# EAGLE design RAMPS_1-3i (EAGLE 5.11)
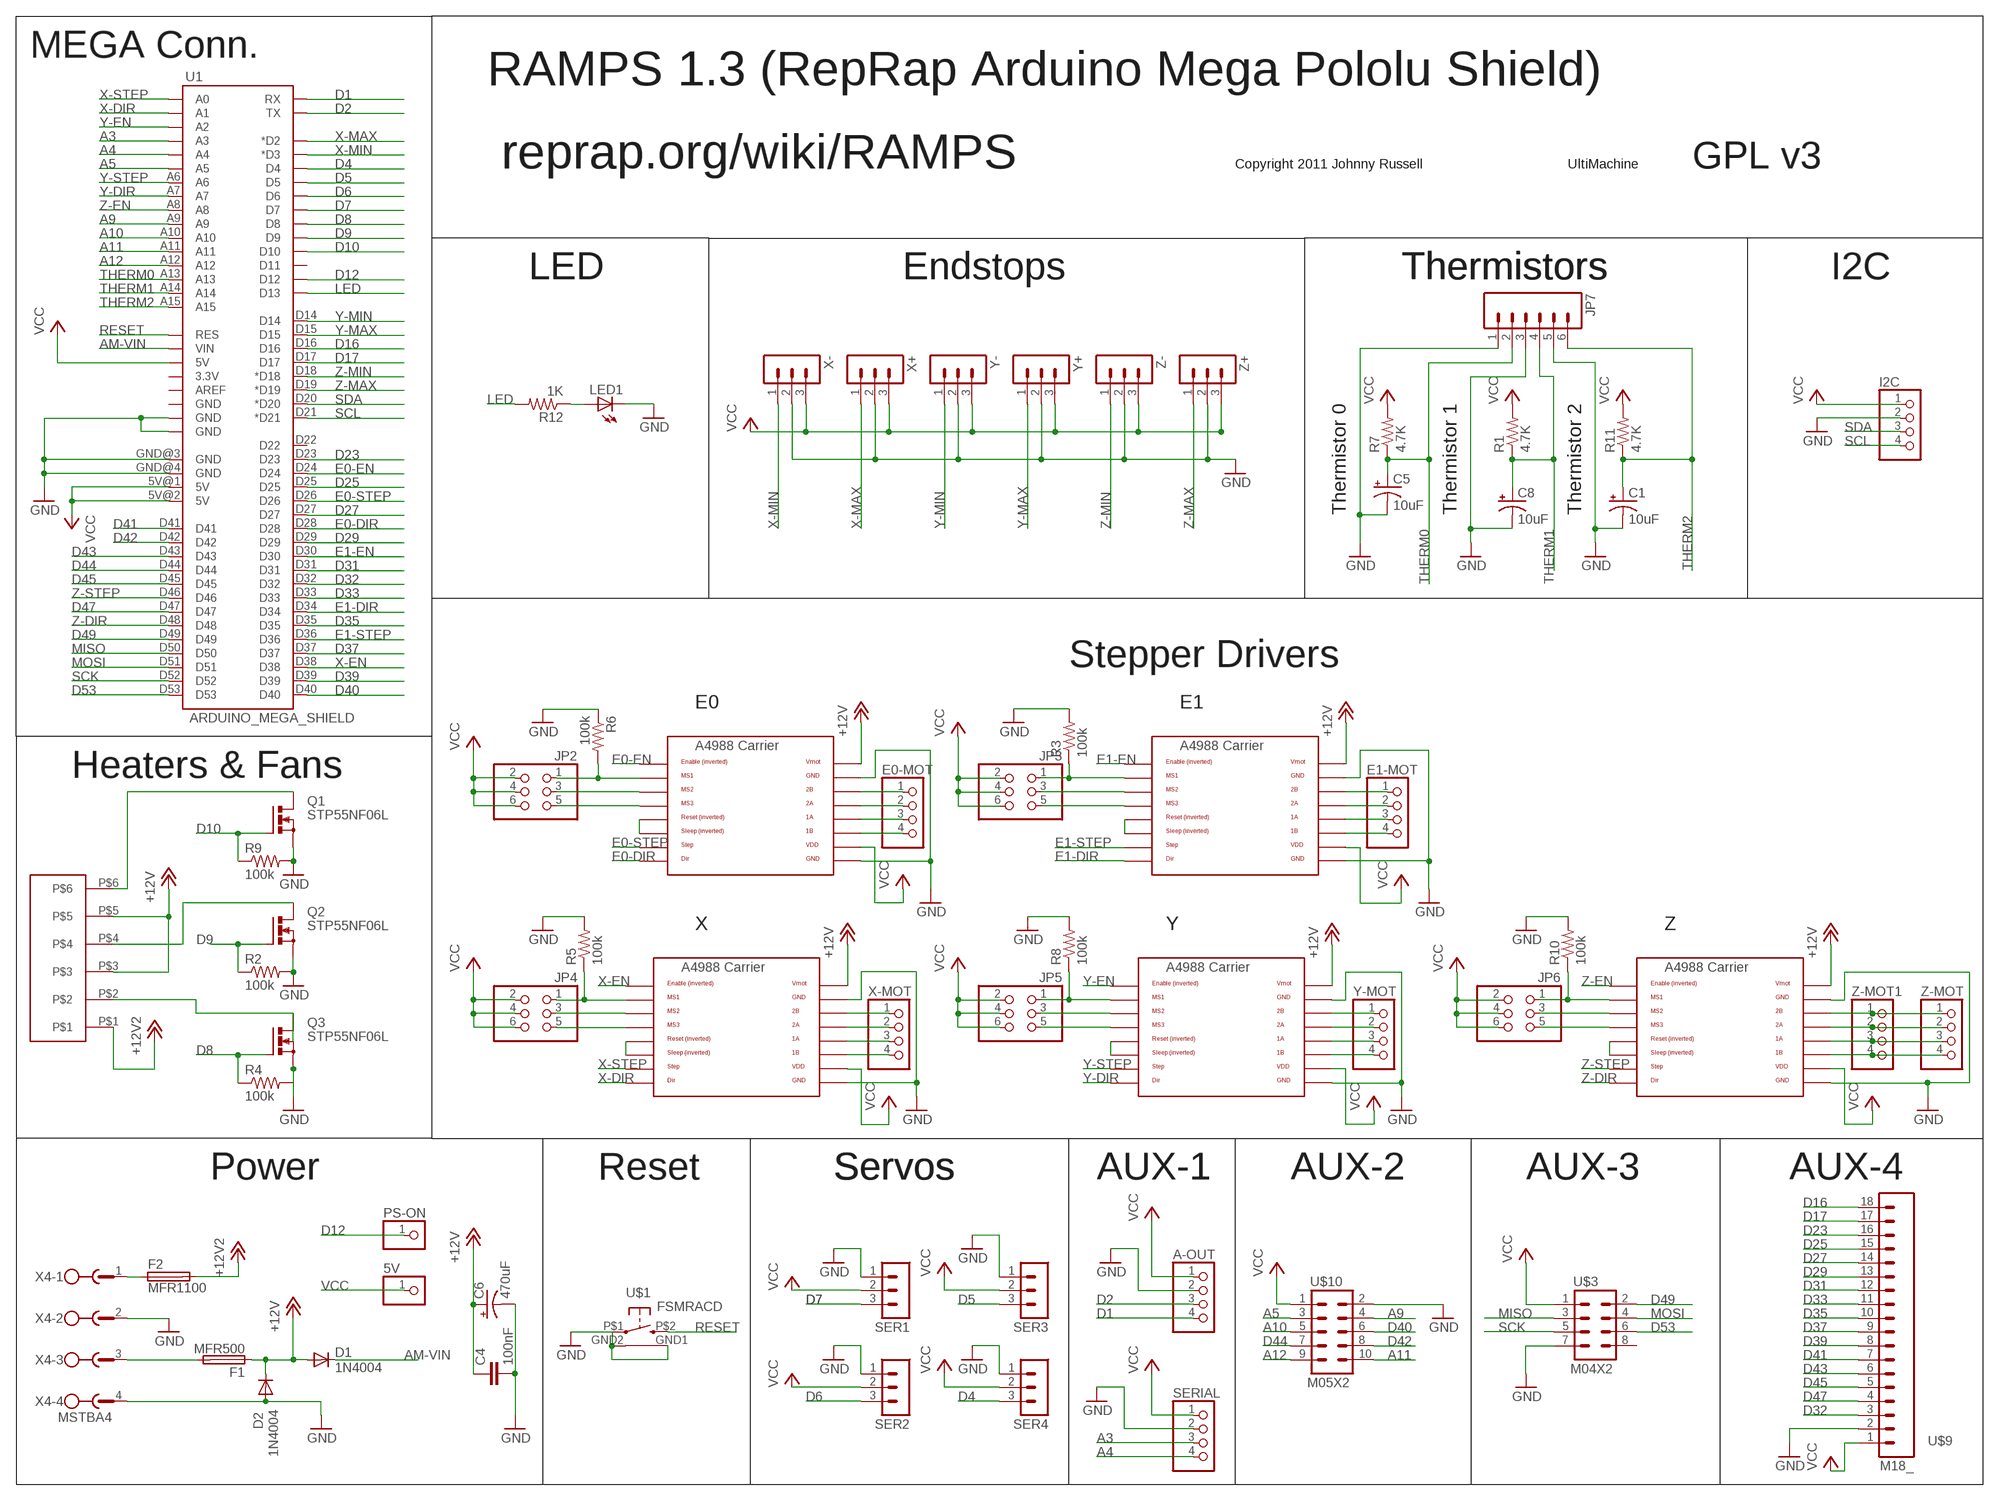
[diagram p0: schematic, sheet 1]

## Parts
5V  PINHD-1X1  [1X01]
A-OUT  PINHD-1X4  [1X04]
C1  10uF  CPOL-USE2.5-5  [E2,5-5]
C4  100nF  C2,5-3  [C2.5-3]
C5  10uF  CPOL-USE2.5-5  [E2,5-5]
C6  470uF  CPOL-USE3.5-8  [E3,5-8]
C8  10uF  CPOL-USE2.5-5  [E2,5-5]
D1  1N4004  [DO41-10]
D2  1N4004  [DO41-10]
E0-MOT  PINHD-1X4  [1X04]
E1-MOT  PINHD-1X4  [1X04]
F1  MFR500  PTCFUSE  [MFR500]
F2  MFR1100  PTCFUSEMFR1100  [MFR1100]
I2C  PINHD-1X4  [1X04]
JP2  PINHD-2X3  [2X03]
JP3  PINHD-2X3  [2X03]
JP4  PINHD-2X3  [2X03]
JP5  PINHD-2X3  [2X03]
JP6  PINHD-2X3  [2X03]
JP7  M06SIP  [1X06]
LED1  LED3MM  [LED3MM]
PS-ON  PINHD-1X1  [1X01]
Q1  STP55NF06L  IRF512  [TO220BV]
Q2  STP55NF06L  IRF512  [TO220BV]
Q3  STP55NF06L  IRF512  [TO220BV]
R1  4.7K  R-US_0207/7  [0207/7]
R2  100k  R-US_0207/7  [0207/7]
R3  100k  R-US_0207/7  [0207/7]
R4  100k  R-US_0207/7  [0207/7]
R5  100k  R-US_0207/7  [0207/7]
R6  100k  R-US_0207/7  [0207/7]
R7  4.7K  R-US_0207/7  [0207/7]
R8  100k  R-US_0207/7  [0207/7]
R9  100k  R-US_0207/7  [0207/7]
R10  100k  R-US_0207/7  [0207/7]
R11  4.7K  R-US_0207/7  [0207/7]
R12  1K  R-US_0207/7  [0207/7]
SER1  3PIN-HEADER  [3PIN-HEADER]
SER2  3PIN-HEADER  [3PIN-HEADER]
SER3  3PIN-HEADER  [3PIN-HEADER]
SER4  3PIN-HEADER  [3PIN-HEADER]
SERIAL  PINHD-1X4  [1X04]
U1  ARDUINO_MEGA_SHIELD  [ARDUINO_MEGA_SHIELD]
U$1  FSMRACD  [FSMRACD]
U$2  282837-6  [282837-6]
U$3  M04X2  [2X4]
U$4  A4988BREAKOUT  [A4988BREAKOUT]
U$5  A4988BREAKOUT  [A4988BREAKOUT]
U$6  A4988BREAKOUT  [A4988BREAKOUT]
U$7  A4988BREAKOUT  [A4988BREAKOUT]
U$8  A4988BREAKOUT  [A4988BREAKOUT]
U$9  M18_  [1X18]
U$10  M05X2  [2X5]
X4  MSTBA4  [MSTBA4]
X+  3PIN-HEADER  [3PIN-HEADER]
X-  3PIN-HEADER  [3PIN-HEADER]
X-MOT  PINHD-1X4  [1X04]
Y+  3PIN-HEADER  [3PIN-HEADER]
Y-  3PIN-HEADER  [3PIN-HEADER]
Y-MOT  PINHD-1X4  [1X04]
Z+  3PIN-HEADER  [3PIN-HEADER]
Z-  3PIN-HEADER  [3PIN-HEADER]
Z-MOT  PINHD-1X4  [1X04]
Z-MOT1  PINHD-1X4  [1X04]

## Nets
+12V: C4.1 C6.+ D1.A D2.C F1.1 U$2.P$3 U$2.P$5 U$4.VMOT U$5.VMOT U$6.VMOT U$7.VMOT U$8.VMOT
+12V2: F2.2 U$2.P$1
A3: SERIAL.3 U1.A3
A4: SERIAL.4 U1.A4
A5: U1.A5 U$10.3
A9: U1.A9 U$10.4
A10: U1.A10 U$10.5
A11: U1.A11 U$10.10
A12: U1.A12 U$10.9
AM-VIN: D1.C U1.VIN
D1: A-OUT.4 U1.RX
D2: A-OUT.3 U1.TX
D4: SER4.3 U1.D4
D5: SER3.3 U1.D5
D6: SER2.3 U1.D6
D7: SER1.3 U1.D7
D8: Q3.G R4.1 U1.D8
D9: Q2.G R2.1 U1.D9
D10: Q1.G R9.1 U1.D10
D12: PS-ON.1 U1.D12
D16: U1.D16 U$9.18
D17: U1.D17 U$9.17
D23: U1.D23 U$9.16
D25: U1.D25 U$9.15
D27: U1.D27 U$9.14
D29: U1.D29 U$9.13
D31: U1.D31 U$9.12
D32: U1.D32 U$9.3
D33: U1.D33 U$9.11
D35: U1.D35 U$9.10
D37: U1.D37 U$9.9
D39: U1.D39 U$9.8
D40: U1.D40 U$10.6
D41: U1.D41 U$9.7
D42: U1.D42 U$10.8
D43: U1.D43 U$9.6
D44: U1.D44 U$10.7
D45: U1.D45 U$9.5
D47: U1.D47 U$9.4
D49: U1.D49 U$3.2
D53: U1.D53 U$3.6
E0-DIR: U1.D28 U$4.DIR
E0-EN: U1.D24 U$4.EN
E0-STEP: U1.D26 U$4.STEP
E1-DIR: U1.D34 U$5.DIR
E1-EN: U1.D30 U$5.EN
E1-STEP: U1.D36 U$5.STEP
GND: A-OUT.2 C1.- C4.2 C5.- C6.- C8.- D2.A I2C.2 JP7.1 JP7.3 JP7.5 LED1.K(C) Q1.S Q2.S Q3.S R2.2 R3.2 R4.2 R5.2 R6.1 R8.2 R9.2 R10.2 SER1.1 SER2.1 SER3.1 SER4.1 SERIAL.2 U1.GND@0(GND) U1.GND@1(GND) U1.GND@3(GND) U1.GND@4(GND) U$1.GND1 U$1.GND2 U$1.P$1(P) U$3.7 U$4.GND U$4.GND@0(GND) U$5.GND U$5.GND@0(GND) U$6.GND U$6.GND@0(GND) U$7.GND U$7.GND@0(GND) U$8.GND U$8.GND@0(GND) U$9.2 U$10.2 X4.2 X4.4 X+.2 X-.2 Y+.2 Y-.2 Z+.2 Z-.2
LED: R12.2 U1.D13
MISO: U1.D50 U$3.3
MOSI: U1.D51 U$3.4
N$1: Q2.D U$2.P$4
N$2: Q3.D U$2.P$2
N$3: E0-MOT.1 U$4.2B
N$4: E0-MOT.2 U$4.2A
N$5: JP2.1 R6.2 U$4.MS1
N$6: JP2.5 U$4.MS3
N$7: Q1.D U$2.P$6
N$8: U$4.RST U$4.SLP(SLEEP)
N$9: JP2.3 U$4.MS2
N$10: E0-MOT.3 U$4.1A
N$11: E0-MOT.4 U$4.1B
N$12: E1-MOT.1 U$5.2B
N$13: E1-MOT.2 U$5.2A
N$14: JP4.1 R5.1 U$6.MS1
N$15: JP4.3 U$6.MS2
N$16: E1-MOT.3 U$5.1A
N$17: JP5.3 U$7.MS2
N$18: E1-MOT.4 U$5.1B
N$19: JP4.5 U$6.MS3
N$20: U$6.RST U$6.SLP(SLEEP)
N$21: U$6.2B X-MOT.1
N$22: U$6.2A X-MOT.2
N$23: U$7.RST U$7.SLP(SLEEP)
N$24: U$5.RST U$5.SLP(SLEEP)
N$25: JP3.1 R3.1 U$5.MS1
N$26: U$6.1A X-MOT.3
N$27: U$6.1B X-MOT.4
N$28: U$7.2B Y-MOT.1
N$29: U$7.2A Y-MOT.2
N$30: U$7.1A Y-MOT.3
N$31: JP5.5 U$7.MS3
N$32: F1.2 X4.3
N$33: JP5.1 R8.1 U$7.MS1
N$34: JP3.5 U$5.MS3
N$35: JP3.3 U$5.MS2
N$36: U$7.1B Y-MOT.4
N$37: JP6.3 U$8.MS2
N$38: U$8.RST U$8.SLP(SLEEP)
N$39: JP6.5 U$8.MS3
N$40: JP6.1 R10.1 U$8.MS1
N$41: U$8.2B Z-MOT1.1 Z-MOT.1
N$42: U$8.2A Z-MOT1.2 Z-MOT.2
N$43: U$8.1A Z-MOT1.3 Z-MOT.3
N$44: U$8.1B Z-MOT1.4 Z-MOT.4
N$45: F2.1 X4.1
N$46: LED1.A R12.1
RESET: U1.RES U$1.P$2(S)
SCK: U1.D52 U$3.5
SCL: I2C.4 U1.D21(*D21)
SDA: I2C.3 U1.D20(*D20)
THERM0: C5.+ JP7.2 R7.1 U1.A13
THERM1: C8.+ JP7.4 R1.1 U1.A14
THERM2: C1.+ JP7.6 R11.1 U1.A15
VCC: 5V.1 A-OUT.1 I2C.1 JP2.2 JP2.4 JP2.6 JP3.2 JP3.4 JP3.6 JP4.2 JP4.4 JP4.6 JP5.2 JP5.4 JP5.6 JP6.2 JP6.4 JP6.6 R1.2 R7.2 R11.2 SER1.2 SER2.2 SER3.2 SER4.2 SERIAL.1 U1.5V@0(5V) U1.5V@1(5V) U1.5V@2(5V) U$3.1 U$4.VDD U$5.VDD U$6.VDD U$7.VDD U$8.VDD U$9.1 U$10.1 X+.3 X-.3 Y+.3 Y-.3 Z+.3 Z-.3
X-DIR: U1.A1 U$6.DIR
X-EN: U1.D38 U$6.EN
X-MAX: U1.D2(*D2) X+.1
X-MIN: U1.D3(*D3) X-.1
X-STEP: U1.A0 U$6.STEP
Y-DIR: U1.A7 U$7.DIR
Y-EN: U1.A2 U$7.EN
Y-MAX: U1.D15 Y+.1
Y-MIN: U1.D14 Y-.1
Y-STEP: U1.A6 U$7.STEP
Z-DIR: U1.D48 U$8.DIR
Z-EN: U1.A8 U$8.EN
Z-MAX: U1.D19(*D19) Z+.1
Z-MIN: U1.D18(*D18) Z-.1
Z-STEP: U1.D46 U$8.STEP
Unconnected: U1.3.3V U1.AREF U1.D11 U1.D22 U1.GND@2(GND) U$3.8

## Notes on the sheet
- MEGA Conn.
- RAMPS 1.3 (RepRap Arduino Mega Pololu Shield)
- reprap.org/wiki/RAMPS | Copyright 2011 Johnny Russell | UltiMachine | GPL v3
- LED | Endstops | Thermistors | Thermistors | I2C
- Thermistor 0 | Thermistor 1 | Thermistor 2
- Stepper Drivers
- E0 | E1
- Heaters & Fans
- X | Y | Z
- Power | Reset | Servos | Servos | AUX-1 | AUX-2 | AUX-3 | AUX-4

## Library data of the parts
5V PS-ON = adafruit:PINHD-1X1: Pin header 1x1 for 0.1" spacing With round pins
A-OUT E0-MOT E1-MOT I2C SERIAL X-MOT Y-MOT Z-MOT Z-MOT1 = RepRapjr:PINHD-1X4: PIN HEADER
C1 C5 C6 C8 = adafruit:CPOL-US: POLARIZED CAPACITOR, American symbol
C4 = capacitor-wima:C: CAPACITOR naming: grid - package width
D1 D2 = diode:1N4004: DIODE general purpose rectifier, 1 A
F1 F2 = RepRapjr:PTCFUSE: LITTLEFUSE Picofuse/slow Littlefuse
JP2-JP6 = pinhead:PINHD-2X3: PIN HEADER
JP7 = SparkFun:M06: Header 6 Standard 6-pin 0.1" header. Use with straight break away headers (SKU : PRT-00116), right angle break away headers (PRT-00553), swiss pins (PRT-00743), machine pins (PRT-00117), and female headers (PRT-00115). Molex polarized connector foot print use with SKU : PRT-08094 with associated crimp pins and housings. NOTES ON THE VARIANTS LOCK and LOCK_LONGPADS... This footprint was designed to help hold the alignment of a through-hole component (i.e. 6-pin header) while soldering it into place. You may notice that each hole has been shifted either up or down by 0.005 of an inch from it's more standard position (which is a perfectly straight line). This slight alteration caused the pins (the squares in the middle) to touch the edges of the holes. Because they are alternating, it causes a "brace" to hold the component in place. 0.005 has proven to be the perfect amount of "off-center" position when using our standard breakaway headers. Although looks a little odd when you look at the bare footprint, once you have a header in there, the alteration is very hard to notice. Also, if you push a header all the way into place, it is covered up entirely on the bottom side. This idea of altering the position of holes to aid alignment will be further integrated into the Sparkfun Library for other footprints. It can help hold any component with 3 or more connection pins.
LED1 = led:LED: LED OSRAM: - CHIPLED LG R971, LG N971, LY N971, LG Q971, LY Q971, LO R971, LY R971 LH N974, LH R974 LS Q976, LO Q976, LY Q976 LO Q996 - Hyper CHIPLED LW Q18S LB Q993, LB Q99A, LB R99A - SideLED LS A670, LO A670, LY A670, LG A670, LP A670 LB A673, LV A673, LT A673, LW A673 LH A674 LY A675 LS A676, LA A676, LO A676, LY A676, LW A676 LS A679, LY A679, LG A679 - Hyper Micro SIDELED® LS Y876, LA Y876, LO Y876, LY Y876 LT Y87S - SmartLED LW L88C, LW L88S LB L89C, LB L89S, LG L890 LS L89K, LO L89K, LY L89K LS L896, LA L896, LO L896, LY L896 - TOPLED LS T670, LO T670, LY T670, LG T670, LP T670 LSG T670, LSP T670, LSY T670, LOP T670, LYG T670 LG T671, LOG T671, LSG T671 LB T673, LV T673, LT T673, LW T673 LH T674 LS T676, LA T676, LO T676, LY T676, LB T676, LH T676, LSB T676, LW T676 LB T67C, LV T67C, LT T67C, LS T67K, LO T67K, LY T67K, LW E67C LS E67B, LA E67B, LO E67B, LY E67B, LB E67C, LV E67C, LT E67C LW T67C LS T679, LY T679, LG T679 LS T770, LO T770, LY T770, LG T770, LP T770 LB T773, LV T773, LT T773, LW T773 LH T774 LS E675, LA E675, LY E675, LS T675 LS T776, LA T776, LO T776, LY T776, LB T776 LHGB T686 LT T68C, LB T68C - Hyper Mini TOPLED® LB M676 - Mini TOPLED Santana® LG M470 LS M47K, LO M47K, LY M47K Source: http://www.osram.convergy.de LUXEON: - LUMILED® LXK2-PW12-R00, LXK2-PW12-S00, LXK2-PW14-U00, LXK2-PW14-V00 LXK2-PM12-R00, LXK2-PM12-S00, LXK2-PM14-U00 LXK2-PE12-Q00, LXK2-PE12-R00, LXK2-PE12-S00, LXK2-PE14-T00, LXK2-PE14-U00 LXK2-PB12-K00, LXK2-PB12-L00, LXK2-PB12-M00, LXK2-PB14-N00, LXK2-PB14-P00, LXK2-PB14-Q00 LXK2-PR12-L00, LXK2-PR12-M00, LXK2-PR14-Q00, LXK2-PR14-R00 LXK2-PD12-Q00, LXK2-PD12-R00, LXK2-PD12-S00 LXK2-PH12-R00, LXK2-PH12-S00 LXK2-PL12-P00, LXK2-PL12-Q00, LXK2-PL12-R00 Source: www.luxeon.com KINGBRIGHT: KA-3528ASYC Source: www.kingbright.com
Q1-Q3 = transistor-power:IRF512: N-CHANNEL MOS FET
R1-R12 = adafruit:R-US_: RESISTOR, American symbol
SER1-SER4 X+ X- Y+ Y- Z+ Z- = ultimachine:3PIN-HEADER: PIN HEADER
U1 = RepRapjr:ARDUINO_MEGA_SHIELD
U$1 = RepRapjr:FSMRACD
U$2 = RepRapjr:282837-6
U$3 = SparkFun:M04X2
U$4-U$8 = RepRapjr:A4988BREAKOUT
U$9 = SparkFun:M18
U$10 = RepRapjr:M05X2
X4 = con-phoenix-508:MSTBA4: PHOENIX

## Board
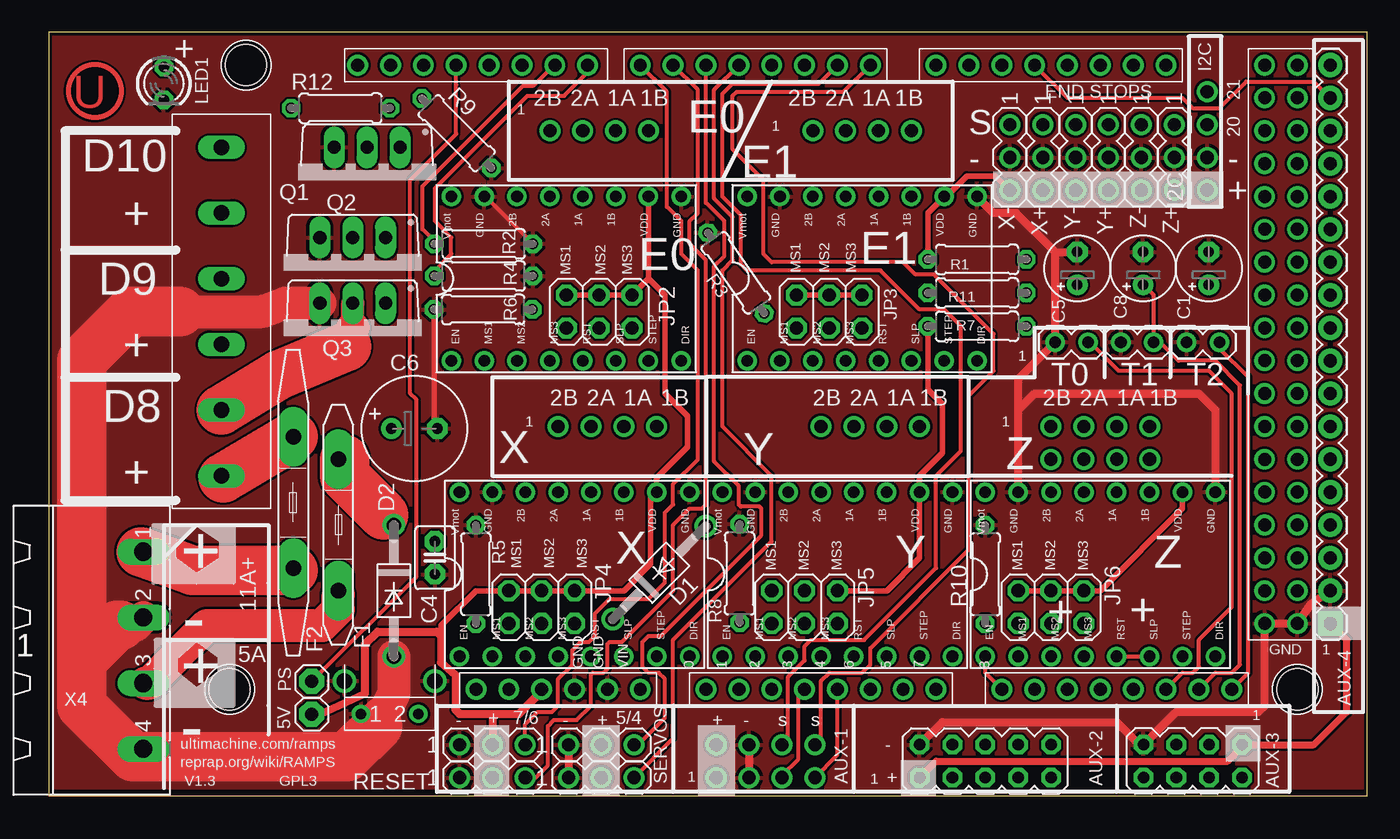
[diagram p1: board, top side]
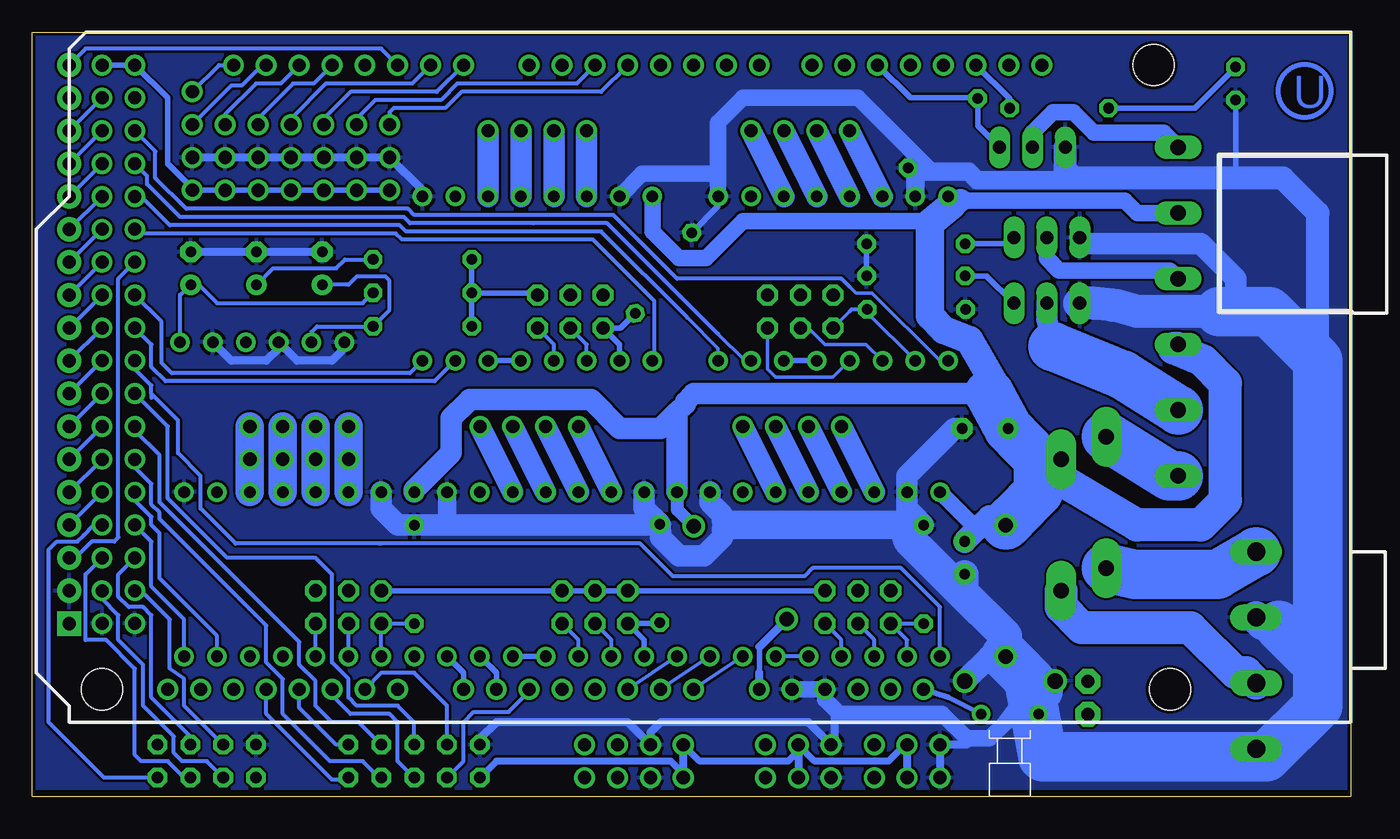
[diagram p2: board, bottom side, seen from below]

Size 101.91 x 59.04 mm. Coordinates in mm from the lower left corner, seen from the top.
Outline: 101.91,0 101.91,59.04 0,59.04 0,0 101.91,0
Copper layers (1*16): Top 0.035mm / dielectric 1.5mm / Bottom 0.035mm
Design rules "ramps1-3 *": minimum track width 7mil, minimum drill 15mil, track to track 7mil, track to pad 7mil, pad to pad 7mil, via to via 7mil, smd to smd 7mil, copper to edge 10mil, drill to drill 8mil, minimum pad ring 12mil, minimum via ring 12mil, stop-mask expansion 4mil, vias tented up to drill 25mil, thermal gap 10mil

### Footprints (pad centres in the part's own frame; a part is rotated, then mirrored left to right if it is on the bottom)
1X01 = drill 1.016 pad 1.93 octagon: 1 0,0
1X04 = drill 1.016 round: 1 -2.54,0; 2 0,0; 3 2.54,0; 4 5.08,0
E2,5-5 = drill 0.813 pad 1.6 round: + -1.27,0 | drill 0.813 pad 1.6 octagon: - 1.27,0
C2.5-3 = drill 0.813 pad 1.6 octagon: 1 -1.27,0; 2 1.27,0
E3,5-8 = drill 0.813 pad 1.6 round: + -1.778,0 | drill 0.813 pad 1.6 octagon: - 1.778,0
DO41-10 = drill 1.118 round: A 5.08,0; C -5.08,0
MFR500 = drill 1.2 pad 2.3 long: 1 -5.08,0; 2 5.08,0
MFR1100 = drill 1.2 pad 2.3 long: 1 -5.08,0; 2 5.08,0
2X03 = drill 1.016 octagon: 1 -2.54,-1.27; 2 -2.54,1.27; 3 0,-1.27; 4 0,1.27; 5 2.54,-1.27; 6 2.54,1.27
1X06 = drill 0.9 pad 1.422 round: 1 0,0; 2 2.54,0; 3 5.08,0; 4 7.62,0; 5 10.16,0; 6 12.7,0
LED3MM = drill 0.813 octagon: A -1.27,0; K 1.27,0
TO220BV = drill 1.016 long: D 0,-2.54; G -2.54,-2.54; S 2.54,-2.54
0207/7 = drill 0.813 octagon: 1 -3.81,0; 2 3.81,0
3PIN-HEADER = drill 1.016 round: 1 -2.54,0; 2 0,0; 3 2.54,0
ARDUINO_MEGA_SHIELD = drill 1 pad 1.422 round: 3.3V 35.56,2.54; 5V@0 38.1,2.54; 5V@1 93.98,50.8; 5V@2 96.52,50.8; A0 50.8,2.54; A1 53.34,2.54; A2 55.88,2.54; A3 58.42,2.54; A4 60.96,2.54; A5 63.5,2.54; A6 66.04,2.54; A7 68.58,2.54; A8 73.66,2.54; A9 76.2,2.54; A10 78.74,2.54; A11 81.28,2.54; A12 83.82,2.54; A13 86.36,2.54; A14 88.9,2.54; A15 91.44,2.54; AREF 23.876,50.8; D2 58.42,50.8; D3 55.88,50.8; D4 53.34,50.8; D5 50.8,50.8; D6 48.26,50.8; D7 45.72,50.8; D8 41.656,50.8; D9 39.116,50.8; D10 36.576,50.8; D11 34.036,50.8; D12 31.496,50.8; D13 28.956,50.8; D14 68.58,50.8; D15 71.12,50.8; D16 73.66,50.8; D17 76.2,50.8; D18 78.74,50.8; D19 81.28,50.8; D20 83.82,50.8; D21 86.36,50.8; D22 93.98,48.26; D23 96.52,48.26; D24 93.98,45.72; D25 96.52,45.72; D26 93.98,43.18; D27 96.52,43.18; D28 93.98,40.64; D29 96.52,40.64; D30 93.98,38.1; D31 96.52,38.1; D32 93.98,35.56; D33 96.52,35.56; D34 93.98,33.02; D35 96.52,33.02; D36 93.98,30.48; D37 96.52,30.48; D38 93.98,27.94; D39 96.52,27.94; D40 93.98,25.4; D41 96.52,25.4; D42 93.98,22.86; D43 96.52,22.86; D44 93.98,20.32; D45 96.52,20.32; D46 93.98,17.78; D47 96.52,17.78; D48 93.98,15.24; D49 96.52,15.24; D50 93.98,12.7; D51 96.52,12.7; D52 93.98,10.16; D53 96.52,10.16; GND@0 40.64,2.54; GND@1 43.18,2.54; GND@2 26.416,50.8; GND@3 93.98,7.62; GND@4 96.52,7.62; RES 33.02,2.54; RX 63.5,50.8; TX 60.96,50.8; VIN 45.72,2.54 | hole 3.2: 96.52,2.54; 13.97,2.54; 15.24,50.8
FSMRACD = drill 1.2 round: GND1 0,3.81; GND2 6.985,3.81 | drill 0.8 round: P$1 1.27,1.27; P$2 5.715,1.27
282837-6 = drill 1.2 long: P$1 0,-12.7; P$2 0,-7.62; P$3 0,-2.54; P$4 0,2.54; P$5 0,7.62; P$6 0,12.7
2X4 = drill 0.9 pad 1.422 octagon: 1 -3.81,-1.27; 2 -3.81,1.27; 3 -1.27,-1.27; 4 -1.27,1.27; 5 1.27,-1.27; 6 1.27,1.27; 7 3.81,-1.27; 8 3.81,1.27
A4988BREAKOUT = drill 0.9 round: 1A 8.89,1.27; 1B 11.43,1.27; 2A 6.35,1.27; 2B 3.81,1.27; DIR 16.51,-11.43; EN -1.27,-11.43; GND 16.51,1.27; GND@0 1.27,1.27; MS1 1.27,-11.43; MS2 3.81,-11.43; MS3 6.35,-11.43; RST 8.89,-11.43; SLP 11.43,-11.43; STEP 13.97,-11.43; VDD 13.97,1.27; VMOT -1.27,1.27
1X18 = drill 1.016 pad 1.88 square: 1 0,0 | drill 1.016 pad 1.88 round: 2 2.54,0; 3 5.08,0; 4 7.62,0; 5 10.16,0; 6 12.7,0; 7 15.24,0; 8 17.78,0; 9 20.32,0; 10 22.86,0; 11 25.4,0; 12 27.94,0; 13 30.48,0; 14 33.02,0; 15 35.56,0; 16 38.1,0; 17 40.64,0; 18 43.18,0
2X5 = drill 0.9 pad 1.422 octagon: 1 -3.81,-1.27; 2 -3.81,1.27; 3 -1.27,-1.27; 4 -1.27,1.27; 5 1.27,-1.27; 6 1.27,1.27; 7 3.81,-1.27; 8 3.81,1.27; 9 6.35,-1.27; 10 6.35,1.27
MSTBA4 = drill 1.397 long: 1 -7.62,5.08; 2 -2.54,5.08; 3 2.54,5.08; 4 7.62,5.08

### Placement (x,y rotation side)
5V  20.32,6.32 0 top
A-OUT  54.13,3.97 0 top
C1  89.66,40.79 90 top
C4  29.84,18.41 270 top
C5  79.5,40.79 90 top
C6  28.26,28.42 0 top
C8  84.58,40.79 90 top
D1  47.19,17.26 45 top
D2  26.67,15.87 270 top
E0-MOT  41.27,51.44 0 top
E1-MOT  61.59,51.44 0 top
F1  22.38,20.95 270 top
F2  18.89,22.7 90 top
I2C  89.53,49.37 90 top
JP2  42.55,37.46 0 top
JP3  60.33,37.46 0 top
JP4  38.1,14.6 0 top
JP5  58.42,14.6 0 top
JP6  77.47,14.6 0 top
JP7  77.79,35.08 0 top
LED1  8.89,55.09 270 top
PS-ON  20.32,8.86 0 top
Q1  24.61,47.62 180 top
Q2  23.49,40.64 180 top
Q3  23.5,35.56 180 top
R1  71.75,41.49 180 top
R2  33.62,42.69 0 top
R3  53.12,40.44 125 top
R4  33.62,40.21 0 top
R5  33.02,17.14 90 top
R6  33.58,37.62 0 top
R7  71.75,36.31 180 top
R8  53.4,17.21 90 top
R9  31.52,51.25 315 top
R10  72.39,17.15 90 top
R11  71.75,38.89 180 top
R12  22.54,53.18 0 top
SER1  34.29,3.97 0 top
SER2  34.29,1.43 0 top
SER3  42.7,3.97 0 top
SER4  42.7,1.43 0 top
SERIAL  54.13,1.43 0 top
U1  0,5.71 0 top
U$1  22.86,5.08 0 top
U$2  13.34,37.47 0 top
U$3  88.42,2.7 180 top
U$4  32.38,45.09 0 top
U$5  55.24,45.09 0 top
U$6  33.02,22.23 0 top
U$7  53.34,22.23 0 top
U$8  73.66,22.23 0 top
U$9  99.06,13.33 90 top
U$10  71.12,2.7 0 top
X4  2.22,11.27 270 top
X+  76.83,49.37 270 top
X-  74.3,49.37 270 top
X-MOT  41.91,28.57 0 top
Y+  81.92,49.37 270 top
Y-  79.38,49.37 270 top
Y-MOT  62.23,28.57 0 top
Z+  87,49.37 270 top
Z-  84.45,49.37 270 top
Z-MOT  80.01,28.58 0 top
Z-MOT1  80.01,26.04 0 top

### Tracks (layer width: path | path; a pad name or v marks a point on that pad's centre or on a via)
+12V
  Top 0.305: 25.88,21.75 | D2.C 25.88,21.75
  Top 0.61: D2.C 26.67,21.11
  Top 3.81: 25.88,21.75 22.86,24.77 22.86,26.04
  Bottom 1.016: D1.A 52.07,22.14 U$7.VMOT
  Bottom 1.27: U$2.P$5 16.51,45.09 17.46,46.04 30.16,46.04 | U$5.VMOT 53.98,43.66 51.91,41.59 49.85,41.59 46.99,44.45 32.86,44.45 32.54,43.82 | U$6.VMOT | 28.89,20.64 U$6.VMOT
  Bottom 1.422: 30.8,45.72 U$4.VMOT
  Bottom 1.676: 28.01,31.88 27.18,31.88 27.94,31.12 50.8,31.12 51.44,30.48 51.44,30.32 52.07,29.69 | U$8.VMOT 72.39,23.65 69.53,26.51 69.53,29.21 68.26,30.48 | 52.07,29.69 U$7.VMOT | 68.26,30.48 | 68.26,30.48 68.1,30.64 58.74,30.64 56.52,28.42 53.34,28.42 52.07,29.69
  Bottom 1.778: C4.1 28.89,20.64 27.94,21.59 26.04,21.59 | 30.8,45.72 30.16,46.04
  Bottom 1.93: U$2.P$3 13.34,34.29 13.65,34.61 | 24.13,26.04 F1.1
  Bottom 2.184: 27.94,31.12 28.01,31.88 27.56,31.91 29.46,35.25 31.43,36.04 32.54,37.15 32.54,43.82 32.54,44.29 30.8,45.72
  Bottom 2.54: 13.65,34.61 11.43,33.66 9.68,31.91 9.68,22.86 11.59,20.95 16.51,20.95 22.86,24.77 24.13,26.04
  Bottom 3.81: D2.C 26.04,21.59 24.13,23.5 24.13,26.04 C6.+ 27.94,31.12
+12V2
  Top 3.81: F2.2 13.49,24.61 | F2.2
  Bottom 3.81: F2.2 13.97,24.77 U$2.P$1
A3
  Top 0.305: U1.A3 57.94,7.78 57.94,2.86 56.67,1.59 SERIAL.3
A4
  Top 0.305: U1.A4 60.96,3.17 SERIAL.4
A5
  Bottom 0.305: U$10.3 68.58,2.7 68.58,5.71 67.79,6.51 65.09,6.51 63.5,8.1 U1.A5
A9
  Bottom 0.305: U1.A9 74.93,9.53 72.39,9.53 69.85,6.99 U$10.4
A10
  Bottom 0.305: U$10.5 73.66,2.7 73.66,5.71 74.3,6.35 77.31,6.35 78.74,7.78 U1.A10
A11
  Bottom 0.305: U1.A11 81.28,6.83 78.42,3.97 U$10.10
A12
  Bottom 0.305: U1.A12 83.82,6.35 78.74,1.27 77.63,1.27 U$10.9
AM-VIN
  Bottom 0.406: 45.72,9.53 45.72,11.54
  Bottom 0.61: 45.72,11.54 D1.C | U1.VIN 45.72,9.53
D1
  Top 0.305: U1.RX 61.44,54.45 53.18,54.45 52.86,54.13 52.86,50.01 55.24,47.62 55.24,41.91 55.88,41.27 66.04,41.27 66.99,40.32 68.42,40.32 73.03,35.72 73.03,32.86 71.12,30.96 71.12,19.05 63.5,11.43 63.5,10.16 62.87,9.53 60.33,9.53 59.69,8.89 59.69,4.45 A-OUT.4
D2
  Top 0.305: U1.TX 59.53,55.09 52.86,55.09 52.07,54.29 52.07,46.36 53.5,44.93 53.5,41.12 53.98,40.64 64.29,40.64 67.31,37.62 69.22,37.62 70.48,36.35 70.48,26.67 68.58,24.77 68.58,17.62 63.02,12.06 58.9,12.06 58.42,11.59 58.42,10.48 57.15,9.21 57.15,4.45 A-OUT.3
D4
  Top 0.305: SER4.3 48.26,4.45 48.26,12.06 55.88,19.69 55.88,24.77 52.07,28.58 52.07,40.64 52.86,41.43 52.86,44.77 51.44,46.2 51.44,54.61 U1.D4
D5
  Top 0.305: SER3.3 45.56,3.97 47.62,6.03 47.62,9.05 47.15,9.53 46.35,9.53 45.88,10 45.88,11.91 46.35,12.38 47.31,12.38 55.09,20.16 55.09,22.23 54.93,22.38 53.5,22.38 53.34,22.54 53.34,23.97 51.44,25.88 51.44,40.96 52.23,41.75 52.23,44.45 50.8,45.88 U1.D5
D6
  Top 0.305: SER2.3 37.62,1.43 38.58,2.38 38.58,5.4 39.05,5.87 40.8,5.87 41.91,6.99 41.91,9.37 42.07,9.53 42.86,9.53 43.18,9.84 43.18,11.75 43.34,11.91 44.29,11.91 48.26,15.87 48.26,20.95 49.53,22.23 50.48,22.23 50.8,22.54 50.8,41.43 49.53,42.7 49.53,44.45 50.16,45.09 50.16,54.61 U1.D6
D7
  Top 0.305: U1.D7 47.78,54.45 47.78,45.56 48.9,44.45 48.9,41.91 50.16,40.64 50.16,26.04 48.26,24.13 48.26,22.54 47.62,21.91 47.62,16.51 46.35,15.24 43.34,15.24 42.23,14.13 42.23,12.38 41.75,11.91 41.12,11.91 40.48,11.27 40.48,10.16 39.37,9.05 39.37,6.99 38.89,6.51 37.78,6.51 36.83,5.56 SER1.3
D8
  Top 0.305: R4.1 29.81,40.6 31.11,41.91 31.11,43.18 29.84,44.45 29.84,46.99 36.99,54.13 39.85,54.13 41.66,55.94 U1.D8
  Bottom 0.406: Q3.G 28.14,40.21 R4.1
D9
  Top 0.305: 29.81,42.9 28.89,43.82 28.89,47.15 36.67,54.93 37.47,54.93 39.05,56.52 U1.D9
  Top 0.406: R2.1 29.81,42.9
  Bottom 0.406: Q2.G 26.52,42.69 R2.1
D10
  Bottom 0.406: U1.D10 34.04,53.98 28.86,53.98 R9.1 28.83,51.85 Q1.G
D12
  Top 0.305: U1.D12 31.5,55.24 31.5,54.99 31.5,51.18 27.94,47.62 27.94,31.12 28.42,30.64 28.42,16.96 PS-ON.1
D16
  Bottom 0.305: U$9.18 97.79,57.79 74.93,57.79 U1.D16 | U$9.18
D17
  Top 0.305: U$9.17 97.79,55.24 92.55,55.24 90.49,53.18 88.42,53.18 87.63,53.98 78.74,53.98 U1.D17 | U$9.17
D23
  Bottom 0.305: U$9.16 U1.D23 | U$9.16
D25
  Bottom 0.305: U$9.15 U1.D25 | U$9.15
D27
  Bottom 0.305: U$9.14 U1.D27 | U$9.14
D29
  Bottom 0.305: U$9.13 U1.D29 | U$9.13
D31
  Bottom 0.305: U$9.12 U1.D31 | U$9.12
D32
  Bottom 0.305: U1.D32 95.25,40.01 95.25,20 95.57,19.69 97.31,19.69 98.27,18.73 98.74,18.73 U$9.3
D33
  Bottom 0.305: U$9.11 U1.D33 | U$9.11
D35
  Bottom 0.305: U$9.10 U1.D35 | U$9.10
D37
  Bottom 0.305: U$9.9 U1.D37 | U$9.9
D39
  Bottom 0.305: U$9.8 U1.D39
D40
  Bottom 0.305: U1.D40 91.44,28.58 91.44,23.02 86.84,18.41 80.01,18.41 78.74,17.15 78.74,10.32 77.47,9.05 77.47,7.62 76.83,6.99 73.66,6.99 72.39,5.71 U$10.6
D41
  Bottom 0.305: U$9.7 U1.D41 | U$9.7
D42
  Bottom 0.305: U1.D42 93.98,28.26 92.08,26.35 92.08,22.7 81.28,11.91 81.28,10.16 80.01,8.89 80.01,6.99 78.74,5.71 76.68,5.71 U$10.8
D43
  Bottom 0.305: U$9.6 U1.D43 | U$9.6
D44
  Bottom 0.305: U1.D44 93.98,25.4 92.71,24.13 92.71,22.54 92.08,21.91 92.08,21.43 83.82,13.18 83.82,10.32 82.55,9.05 82.55,6.35 78.9,2.7 76.36,2.7 75.09,1.43 U$10.7
D45
  Bottom 0.305: U$9.5 U1.D45 | U$9.5
D47
  Bottom 0.305: U$9.4 U1.D47 | U$9.4
D49
  Bottom 0.305: U$3.2 96.36,1.43 100.65,5.71 100.65,19.05 100.01,19.69 98.42,19.69 97.95,20.16 | U1.D49 97.16,20.95 97.95,20.16 | 97.95,20.16
D53
  Bottom 0.305: U1.D53 96.52,15.24 95.25,13.97 95.25,12.06 93.34,10.16 93.34,6.99 90.96,4.6 90.96,3.33 90.33,2.7 88.42,2.7 U$3.6 | U$3.6
E0-DIR
  Bottom 0.254: 51.28,36.99 48.9,34.61 U$4.DIR
  Bottom 0.305: U1.D28 93.5,46.36 91.28,44.13 73.5,44.13 73.03,43.66 57.94,43.66 51.28,36.99
E0-EN
  Bottom 0.254: 38.73,39.37 38.26,38.89 36.99,38.89 31.75,33.66 U$4.EN
  Bottom 0.305: 38.73,39.37 39.37,40.01 52.07,40.01 56.99,44.93 72.39,44.93 72.87,45.4 90.01,45.4 92.39,47.78 92.39,49.85 U1.D24
E0-STEP
  Bottom 0.254: 48.9,35.72 46.83,33.66 U$4.STEP
  Bottom 0.305: 63.18,44.29 | 63.18,44.29 72.71,44.29 73.18,44.77 90.49,44.77 93.03,47.31 93.03,47.94 U1.D26 | 63.18,44.29 57.47,44.29 48.9,35.72
E1-DIR
  Bottom 0.305: U1.D34 91.92,36.67 91.92,33.5 91.12,32.7 72.71,32.7 U$5.DIR
E1-EN
  Bottom 0.305: U1.D30 93.66,43.5 73.82,43.5 73.34,43.02 58.58,43.02 53.82,38.26 53.82,33.81 U$5.EN
E1-STEP
  Bottom 0.305: U1.D36 92.71,34.93 92.71,33.18 91.6,32.07 70.8,32.07 U$5.STEP
GND
  Top 0.305: C5.- | 33.66,46.3 33.81,46.3 R2.2 | 77.79,42.07
  Top 0.406: U$4.GND@0 33.66,46.3 | R6.1 29.77,28.68 C6.-
  Top 0.61: 77.79,42.07 C5.- | 77.79,42.07 74.77,45.09 73.03,45.09 U$5.GND | U$8.GND 90.17,29.84 88.9,31.12 76.2,31.12 74.93,29.84 | U$3.7 87.15,6.51 93.5,6.51 93.98,6.99 U1.GND@3 U1.GND@4 97.63,14.92 U$9.2 | U$10.2 69.06,5.71 82.55,5.71 84.3,3.97 U$3.7 | U$9.2 | U$8.GND@0 74.93,29.84 | U$3.7 | A-OUT.2 SERIAL.2 | SER3.1 SER4.1 | 77.79,42.07 JP7.1 74.93,32.23 74.93,29.84
  Top 1.778: D2.A 26.67,10.95
  Top 2.54: 25.4,5.4 25.4,5.71 25.56,5.87 25.56,6.35 26.04,6.67 26.67,7.94 D2.A | Q3.S 18.26,38.1 16.51,37.47 10.16,37.47 | 5.56,13.18 6.67,13.18 X4.2
  Top 3.81: 25.4,5.4 23.02,3.02 6.51,3.02 | 10.16,37.47 6.35,37.47 2.54,33.66 2.54,6.99 6.51,3.02 | 6.51,3.02 6.67,3.02 | 6.51,3.02 | 5.56,13.18 5.24,13.18 2.7,10.64
  Bottom 0.305: JP7.3 82.87,34.61 | Z+.2
  Bottom 0.406: R2.2 R4.2 | R3.2 48.9,45.6 U$4.GND | 8.89,47.78 LED1.K
  Bottom 0.61: I2C.2 Z+.2 Z-.2 Y+.2 Y-.2 X+.2 X-.2 71.75,46.83 U$5.GND | 82.87,34.61 83.82,33.66 86.52,33.66 JP7.5 | JP7.1 77.79,34.61 78.74,33.66 81.44,33.66 JP7.3 | C5.- C8.- C1.- | U$10.2 67.31,4.45 66.04,5.71 55.88,5.71 A-OUT.2 54.13,4.92 53.34,5.71 41.91,5.71 SER3.1 39.91,4.23 39.91,6.56 39.74,6.56 39.53,6.35 | 29.21,4.45 29.69,3.97 SER1.1 SER2.1 | SER2.1
  Bottom 1.27: U1.GND@1 U1.GND@0 40.64,7.46 39.53,6.35 31.59,6.35 29.69,4.45 29.21,4.45 27.94,4.45 26.67,5.71 24.77,8.26 D2.A | 48.9,48.1 48.9,52.07 46.99,53.98 38.1,53.98 32.38,48.26 | 48.9,48.1 U$4.GND | U$5.GND@0 54.77,48.1 48.9,48.1
  Bottom 1.422: 69.85,20.95 U$7.GND | 21.43,47.78 21.27,47.62 28.89,47.62 29.53,48.26 32.38,48.26 33.66,48.26 U$4.GND@0
  Bottom 1.676: 8.89,37.47 8.89,40.01 11.59,42.7 20.48,42.7 Q2.S | R5.2 | R5.2 34.29,22.23 U$6.GND@0 | U$6.GND@0 | U$6.GND@0 34.29,24.77 30.64,28.42 C6.- | R5.2 33.27,21.2 | U$8.GND@0 74.93,22.23 73.66,20.95 R10.2 69.85,20.95 53.34,20.95 | U$7.GND@0 54.61,22.23 R8.2 53.34,20.95 | 53.34,20.95 53.34,20 51.91,18.57 50.01,18.57 48.58,20 48.58,20.64 48.26,20.95 48.58,21.27 48.58,21.75 49.53,22.7 U$6.GND | 34.29,20.95 R5.2 | R5.2
  Bottom 1.778: 2.54,32.38 2.54,45.09 5.24,47.78 8.89,47.78 21.43,47.78 22.07,48.42 Q1.S | U$1.GND2 27.94,10.79 D2.A 24.77,8.89 U$1.GND1 | 24.13,8.26 U$1.P$1
  Bottom 1.93: 5.56,13.18 6.67,13.18 X4.2 | 6.51,3.02 6.83,3.17 X4.4
  Bottom 2.184: 34.29,20.95 48.26,20.95 | C4.2 29.84,16.51 30.32,16.03
  Bottom 2.54: X4.2 6.83,13.33 | 10.16,37.47 16.51,37.47 18.26,37.94 18.41,37.94 19.84,38.1 Q3.S | D2.A 26.67,12.38 30.32,16.03 34.13,19.84 34.13,20.8 34.29,20.95
  Bottom 3.81: 10.16,37.47 8.89,37.47 6.35,37.47 2.54,33.66 2.54,32.38 2.54,10.79 | 2.54,10.79 2.54,6.99 6.51,3.02 | 2.54,10.79 3.17,10.79 5.56,13.18 | D2.A 24.13,8.26 24.77,8.26 23.81,3.02 6.51,3.02 | 6.51,3.02
  pour Top: 0,59.05 101.6,59.05 101.6,0.63 0,0.63
  pour Bottom: 0,59.05 101.6,59.05 101.6,0.63 0,0.63
LED
  Bottom 0.406: U1.D13 26.35,53.91 R12.2
MISO
  Bottom 0.305: U1.D50 95.25,17.15 95.25,15.4 94.46,14.6 93.34,14.6 92.71,13.97 92.71,7.62 89.69,4.6 U$3.3 | U$3.3
MOSI
  Bottom 0.305: U1.D51 97.79,17.15 97.79,12.06 96.2,12.06 93.98,9.84 93.98,3.17 93.5,2.7 91.44,2.7 90.17,1.43 U$3.4
N$1
  Bottom 1.27: Q2.D 23.5,41.59 22.54,40.64 13.97,40.64 U$2.P$4
N$2
  Top 1.778: 23.5,36.2 Q3.D
  Top 2.54: 23.02,34.77 23.5,36.2
  Top 3.81: U$2.P$2 17.78,32.54 23.02,34.77
  Bottom 1.676: Q3.D 23.5,36.83 23.02,34.77
  Bottom 3.81: 23.02,34.77 17.62,32.54 U$2.P$2
N$3
  Bottom 1.676: U$4.2B E0-MOT.1
N$4
  Bottom 1.676: U$4.2A E0-MOT.2
N$5
  Bottom 0.254: U$4.MS1 37.39,37.39 R6.2 | 38.74,37.46 JP2.1
  Bottom 0.305: 38.74,37.46 38.58,37.62 R6.2
N$6
  Bottom 0.254: U$4.MS3 40.01,32.38 44.45,32.38 45.09,33.02 JP2.5
N$7
  Bottom 1.27: 24.61,50.96 Q1.D 24.61,51.28 23.02,52.86 21.43,52.86 19.84,51.28 14.45,51.28 U$2.P$6
N$8
  Bottom 0.406: U$4.RST U$4.SLP
N$9
  Bottom 0.254: U$4.MS2 37.47,34.93 40.64,34.93 41.91,36.2 JP2.3
N$10
  Bottom 1.676: U$4.1A E0-MOT.3
N$11
  Bottom 1.676: U$4.1B E0-MOT.4
N$12
  Bottom 1.676: U$5.2B E1-MOT.1
N$13
  Bottom 1.676: U$5.2A E1-MOT.2
N$14
  Bottom 0.305: R5.1 JP4.1 34.29,12.06 U$6.MS1 | R5.1 | U$6.MS1
N$15
  Bottom 0.305: JP4.3 36.83,12.06 U$6.MS2 | U$6.MS2
N$16
  Bottom 1.676: U$5.1A E1-MOT.3
N$17
  Bottom 0.305: JP5.3 57.15,12.06 U$7.MS2
N$18
  Bottom 1.676: U$5.1B E1-MOT.4
N$19
  Bottom 0.305: JP4.5 39.37,12.06 U$6.MS3 | U$6.MS3
N$20
  Bottom 0.305: U$6.RST U$6.SLP
N$21
  Bottom 1.676: U$6.2B X-MOT.1
N$22
  Bottom 1.676: U$6.2A X-MOT.2
N$23
  Bottom 0.406: U$7.RST U$7.SLP
N$24
  Bottom 0.406: U$5.RST U$5.SLP
N$25
  Bottom 0.406: U$5.MS1 56.52,34.93 JP3.1 56.43,36.2 R3.1
N$26
  Bottom 1.676: U$6.1A X-MOT.3
N$27
  Bottom 1.676: U$6.1B X-MOT.4
N$28
  Bottom 1.676: U$7.2B Y-MOT.1
N$29
  Bottom 1.676: U$7.2A Y-MOT.2
N$30
  Bottom 1.676: U$7.1A Y-MOT.3
N$31
  Bottom 0.305: JP5.5 59.69,12.06 U$7.MS3
N$32
  Top 0.61: X4.3 7.46,8.73
  Top 2.54: 7.46,8.73 7.78,8.73 12.22,13.18 21.11,13.18 22.38,14.45 22.38,15.56
  Bottom 2.54: X4.3 8.1,9.53 8.89,9.53 12.38,13.02 20.8,13.02 22.38,14.6 F1.2
N$33
  Bottom 0.406: U$7.MS1 54.61,12.06 JP5.1 53.47,13.33 R8.1
N$34
  Bottom 0.305: U$5.MS3 61.59,34.93 JP3.5
N$35
  Bottom 0.305: U$5.MS2 59.05,34.93 JP3.3
N$36
  Bottom 1.676: U$7.1B Y-MOT.4
N$37
  Bottom 0.305: U$8.MS2 JP6.3
N$38
  Top 0.305: U$8.RST U$8.SLP
N$39
  Bottom 0.305: U$8.MS3 JP6.5
N$40
  Bottom 0.305: U$8.MS1 JP6.1 R10.1
N$41
  Bottom 2.184: U$8.2B Z-MOT1.1 Z-MOT.1
N$42
  Bottom 2.184: U$8.2A Z-MOT1.2 Z-MOT.2
N$43
  Bottom 2.184: U$8.1A Z-MOT1.3 Z-MOT.3
N$44
  Bottom 2.184: U$8.1B Z-MOT1.4 Z-MOT.4
N$45
  Top 0.61: 18.89,17.46 17.94,18.41 17.78,18.41 18.57,17.62 F2.1
  Top 3.81: 7.14,18.89 11.11,17.46 18.89,17.46
  Bottom 3.81: X4.1 10.32,17.15 16.67,17.15 F2.1
N$46
  Bottom 0.406: LED1.A 12.06,53.18 R12.1
RESET
  Bottom 0.406: U$1.P$2 31.11,7.62 U1.RES
SCK
  Bottom 0.305: U1.D52 93.82,15.72 93.34,15.72 91.28,13.65 91.28,9.84 90.17,9.05 90.17,6.99 U$3.5 | U$3.5
SCL
  Bottom 0.305: I2C.4 87.47,56.52 U1.D21
SDA
  Bottom 0.305: I2C.3 86.52,54.93 85.72,54.93 84.14,56.52 U1.D20
THERM0
  Top 0.305: 81.6,33.97 82.71,32.86 89.69,32.86 91.44,31.12 91.44,14.6 88.9,12.06 88.9,10 88.42,9.53 87.63,9.53 U1.A13 | 81.6,33.97 | 81.6,33.97 80.8,34.77 80.64,34.77 JP7.2
  Bottom 0.305: JP7.2 80.33,35.88 79.9,36.31 R7.1 74.3,37.58 74.3,39.85 74.61,40.16 76.83,40.16 77.47,39.53 C5.+
THERM1
  Top 0.305: C8.+ 84.62,39.52 85.41,38.74 JP7.4 85.88,35.08 87.31,33.66 90.17,33.66 92.08,31.75 92.08,10.16 91.44,9.53 90.17,9.53 U1.A14
  Bottom 0.305: R1.1 77.73,41.49 78.42,40.8 83.28,40.8 84.56,39.52 C8.+
THERM2
  Top 0.305: U1.A15 92.71,9.53 92.71,32.38 90.49,34.61 JP7.6
  Bottom 0.305: R11.1 76.36,38.1 87.63,38.1 89.06,39.53 89.06,39.52 C1.+ | JP7.6 90.49,38.73 89.7,39.52 C1.+ | 89.09,39.5 89.12,39.52 C1.+
VCC
  Top 0.406: JP6.2 JP6.4 JP6.6 81.28,15.87 87.63,22.23 U$8.VDD | JP3.6 JP3.4 JP3.2 | JP2.2 JP2.4 JP2.6 46.35,40.01 | 46.35,40.01 U$4.VDD | R1.2 67.94,45.09 U$5.VDD 69.37,46.36 70.96,47.94 73.18,47.94 X-.3 | JP5.6 64.77,15.87 67.31,18.41 U$7.VDD 67.31,24.77 69.06,26.51 69.06,30.32 67.94,31.43 R7.2 | 46.83,23.5 46.51,23.18 46.51,17.94 44.45,15.87 JP4.6 JP4.4 JP4.2 33.02,15.87 30.32,13.18 30.32,12.38 | 46.35,40.01 47.62,38.73 47.62,31.12 49.37,29.37 49.37,26.99 46.99,24.61 U$6.VDD
  Top 0.559: 92.23,3.81 91.12,2.7 68.58,2.7 U$10.1 | U$9.1 100.33,12.06 100.33,6.51 97.79,3.97 U$3.1
  Top 0.61: 34.29,6.35 31.75,6.35 31.43,6.67 31.43,9.37 30.32,10.32 30.32,12.38 30,12.7 25.4,12.7 24.45,11.75 24.45,7.94 20.95,6.32 5V.1 | 34.29,6.35 36.35,6.35 38.1,8.1 U1.5V@0 | 34.29,6.35 34.29,4.13 SER1.2 | 46.83,23.5 U$6.VDD | 92.23,3.81 U$3.1
  Bottom 0.305: X-.3 74.3,46.51 | JP3.4 59.69,38.73 | 59.69,38.73 | JP3.4 59.69,38.73 | JP3.4 | 63.02,38.89 JP3.6 | SER1.2 34.45,3.97 | I2C.1
  Bottom 0.406: I2C.1 Z+.3 Z-.3 Y+.3 Y-.3 X+.3 X-.3 | R11.2 63.02,38.89 | R11.2 R1.2 | U1.5V@2 U1.5V@1 91.44,53.98 91.44,48.9 89.53,46.99 | JP6.2 JP5.6 JP5.4 JP5.2 JP4.6 | R7.2 R11.2
  Bottom 0.559: 51.59,1.75 52.55,2.7 66.04,2.7 U$10.1 | A-OUT.1 50.32,2.7 43.5,2.7 42.7,3.49 | SER3.2 41.43,2.7 35.72,2.7 34.45,3.97
  Bottom 0.61: I2C.1 89.53,46.99 | 51.59,1.75 SERIAL.1 A-OUT.1 | 42.7,3.49 SER3.2 SER4.2 | SER2.2 | SER1.2 SER2.2
X-DIR
  Bottom 0.305: U$6.DIR U1.A1
X-EN
  Bottom 0.305: U1.D38 93.98,33.02 92.71,31.75 92.71,31.12 | 92.71,31.12 92.71,30.8 | 92.71,31.12 90.65,29.05 90.65,26.51 88.9,24.77 88.9,22.23 86.2,19.53 75.09,19.53 74.93,19.53 54.93,19.53 52.39,16.99 42.23,16.99 41.59,17.62 34.77,17.62 31.75,14.6 U$6.EN | U$6.EN
X-MAX
  Bottom 0.305: X+.1 76.83,52.39 75.41,53.82 70.33,53.82 69.06,55.09 59.85,55.09 U1.D2
X-MIN
  Bottom 0.305: X-.1 74.3,52.86 73.98,53.18 70.01,53.18 68.74,54.45 57.94,54.45 U1.D3
X-STEP
  Bottom 0.305: U$6.STEP U1.A0
Y-DIR
  Bottom 0.305: U1.A7
  Bottom 0.406: U1.A7 68.58,9.53 U$7.DIR
Y-EN
  Bottom 0.305: U$7.EN U1.A2
Y-MAX
  Bottom 0.305: Y+.1 81.92,52.39 79.22,55.09 72.55,55.09 U1.D15
Y-MIN
  Bottom 0.305: Y-.1 79.38,52.39 77.31,54.45 70.64,54.45 U1.D14
Y-STEP
  Bottom 0.305: U1.A6
  Bottom 0.406: U1.A6 66.04,9.53 U$7.STEP
Z-DIR
  Bottom 0.305: U$8.DIR 90.17,13.65 92.71,16.19 92.71,19.69 U1.D48
Z-EN
  Top 0.305: U1.A8 72.39,9.53 U$8.EN
Z-MAX
  Bottom 0.305: Z+.1 87,52.7 84.61,55.09 82.71,55.09 U1.D19
Z-MIN
  Bottom 0.305: Z-.1 84.45,52.39 81.76,55.09 80.17,55.09 U1.D18
Z-STEP
  Bottom 0.305: U$8.STEP 87.63,12.38 92.08,16.83 92.08,20.32 92.71,20.95 92.71,21.59 93.82,22.7 93.82,23.34 U1.D46
(copper drawn outside any net)
  shapes: Bottom circle x2, Top circle x1

### Text on the board
Top: U
Bottom: U
tNames: 2B | 2A | 1A | 1B | 2B | 2A | 1A | 1B | MS1 | MS2 | MS3 | MS1 | MS2 | MS3 | 2B | 2A | 1A | 1B | 2B | 2A | 1A | 1B | 2B | 2A | 1A | 1B | MS1 | MS2 | MS3 | MS1 | MS2 | MS3 | MS1 | MS2 | MS3 | 11A+ | 5A | GND | GND | GND | VIN | 0 | 1 | 2 | 3 | 4 | 6 | 5 | 7 | 8 | RESET
Document: RAMPS 1.3 (RepRap Arduino MEGA Pololu Shield) | GPL v3 | reprap.org/wiki/RAMPS | Reversing input power, and inserting stepper drivers incorrectly will destroy electronics. | I2C | 21 | 20 | 12-35V Out | GND | 5V | - | D10 | + | AUX-4 | D16 | - | D17 | D9 | + | D23 | D25 | - | D11 | D27 | + | D29 | D31 | 12-35VDC In | D33 | + | D35 | 11A | D37 | - | D38 | D41 | + | 5A | D43 | - | D45 | SERVOS | AUX-1 | AUX-2 | AUX-3 / SPI | D47 | A9 | A11 | SCK | MISO | D32 | GND | 5V | D7 | GND | 5V | D5 | 5V | GND | D2 | D1 | GND | D63 | D48 | D42 | D65 | GND | D52 | D50 | 5V | GND | GND | 5V | D6 | GND | 5V | D4 | 5V | GND | A3 | A4 | 5V | A5 | A10 | D44 | A12 | NC | D53 | MOSI | D49 | D57 | D58 | D59 | D64 | D66 | D51 | 5V | Copyright 2011 Johnny Russell - UltiMachine
_tsilk: + | I2C | END STOPS | 21 | 1 | E0 | 1 | S | 20 | D10 | - | - | E1 | + | + | E1 | E0 | D9 | + | 1 | T0 | T1 | T2 | D8 | 1 | 1 | X | Y | Z | + | + | X | Y | Z | + | + | - | 1 | 1 | + | PS | AUX-4 | - | + | 7/6 | - | + | 5/4 | + | - | s | s | 1 | - | ultimachine.com/ramps | - | reprap.org/wiki/RAMPS | 1 | V1.3 | GPL3 | SERVOS | AUX-1 | 1 | + | AUX-2 | AUX-3